# Altium schematic sheet 003-00004.SchDoc: <title>
size C; Organization: Custom Embedded Solutions, LLC.; Address1: 130 Oakland Trace; Address2: Madison, AL 35758; DocumentNumber: <doc_num>; Revision: <Rev>; SheetNumber: 1; SheetTotal: 8; PageTitle: Block Diagram
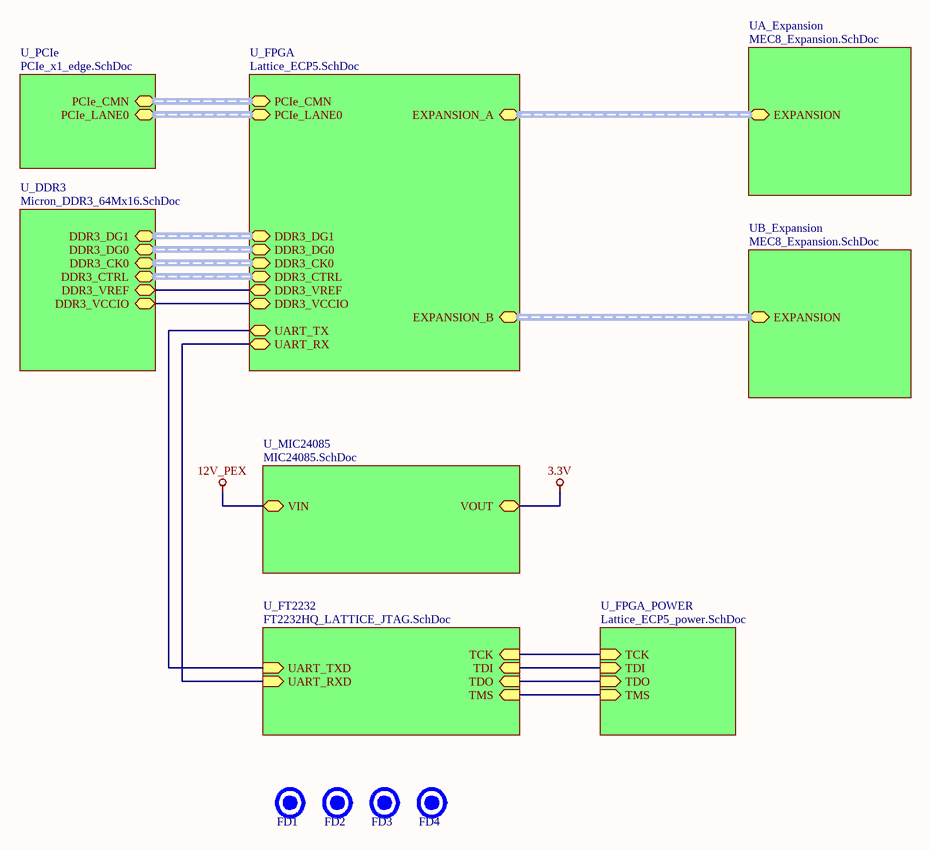
[diagram p0: 003-00004.SchDoc]

## Parts
FD1  (no value)  [005-00024]  (no BOM)
FD2  (no value)  [005-00024]  (no BOM)
FD3  (no value)  [005-00024]  (no BOM)
FD4  (no value)  [005-00024]  (no BOM)

## Sub-sheets
U_DDR3 = Micron_DDR3_64Mx16.SchDoc: DDR3_DG1 (harness DDR3_DATAGRP), DDR3_DG0 (harness DDR3_DATAGRP), DDR3_CK0 (harness DDR3_CLK), DDR3_CTRL (harness DDR3_CTRL), DDR3_VREF, DDR3_VCCIO
U_FPGA = Lattice_ECP5.SchDoc: PCIe_CMN (harness PCIe_COMMON), PCIe_LANE0 (harness PCIe_LANE), EXPANSION_A (harness GPIO_EXPANSION), EXPANSION_B (harness GPIO_EXPANSION), DDR3_DG1 (harness DDR3_DATAGRP), DDR3_DG0 (harness DDR3_DATAGRP), DDR3_CK0 (harness DDR3_CLK), DDR3_CTRL (harness DDR3_CTRL), DDR3_VREF, DDR3_VCCIO, UART_TX, UART_RX
U_FPGA_POWER = Lattice_ECP5_power.SchDoc: TCK (in), TDI (in), TDO (in), TMS (in)
U_FT2232 = FT2232HQ_LATTICE_JTAG.SchDoc: TCK (in), TDI (in), TDO (in), TMS (in), UART_TXD (in), UART_RXD (in)
U_MIC24085 = MIC24085.SchDoc: VIN, VOUT
U_PCIe = PCIe_x1_edge.SchDoc: PCIe_CMN (harness PCIe_COMMON), PCIe_LANE0 (harness PCIe_LANE)
UA_Expansion = MEC8_Expansion.SchDoc: EXPANSION (harness GPIO_EXPANSION)
UB_Expansion = MEC8_Expansion.SchDoc: EXPANSION (harness GPIO_EXPANSION)

## Nets
3.3V: sheet U_MIC24085/VOUT
12V_PEX: sheet U_MIC24085/VIN
(unnamed): sheet U_FPGA/DDR3_VREF, sheet U_DDR3/DDR3_VREF
(unnamed): sheet U_FPGA/DDR3_VCCIO, sheet U_DDR3/DDR3_VCCIO
(unnamed): sheet U_FPGA/UART_TX, sheet U_FT2232/UART_TXD
(unnamed): sheet U_FPGA/UART_RX, sheet U_FT2232/UART_RXD
(unnamed): sheet U_FPGA_POWER/TCK, sheet U_FT2232/TCK
(unnamed): sheet U_FPGA_POWER/TDI, sheet U_FT2232/TDI
(unnamed): sheet U_FPGA_POWER/TDO, sheet U_FT2232/TDO
(unnamed): sheet U_FPGA_POWER/TMS, sheet U_FT2232/TMS

## Buses and harness runs
harness sheet U_DDR3/DDR3_CK0 = sheet U_FPGA/DDR3_CK0
harness sheet U_DDR3/DDR3_CTRL = sheet U_FPGA/DDR3_CTRL
harness sheet U_DDR3/DDR3_DG0 = sheet U_FPGA/DDR3_DG0
harness sheet U_DDR3/DDR3_DG1 = sheet U_FPGA/DDR3_DG1
harness sheet U_FPGA/EXPANSION_A = sheet UA_Expansion/EXPANSION
harness sheet U_FPGA/EXPANSION_B = sheet UB_Expansion/EXPANSION
harness sheet U_FPGA/PCIe_CMN = sheet U_PCIe/PCIe_CMN
harness sheet U_FPGA/PCIe_LANE0 = sheet U_PCIe/PCIe_LANE0

## Notes on the sheet
- Copyright (c)
- Page Title
- Design Title
- Creative Commons License, http://creativecommons.org/licenses/by/4.0/legalcode
  This PCB design by Custom Embedded Solutions, LLC. is licensed under a Creative Commons Attribution 4.0 International License.
- Size:
- Date:
- File:
- C
- Document Number:
- Time:
- Sheet
- Rev:
- of

## Library data of the parts
FD1-FD4 = 008-00008: PCB fiducial, IPC-7351; Part Number: 008-00008; Package: Edge Connector, MEC8-30